# Altium schematic sheet display-header.SchDoc
size A
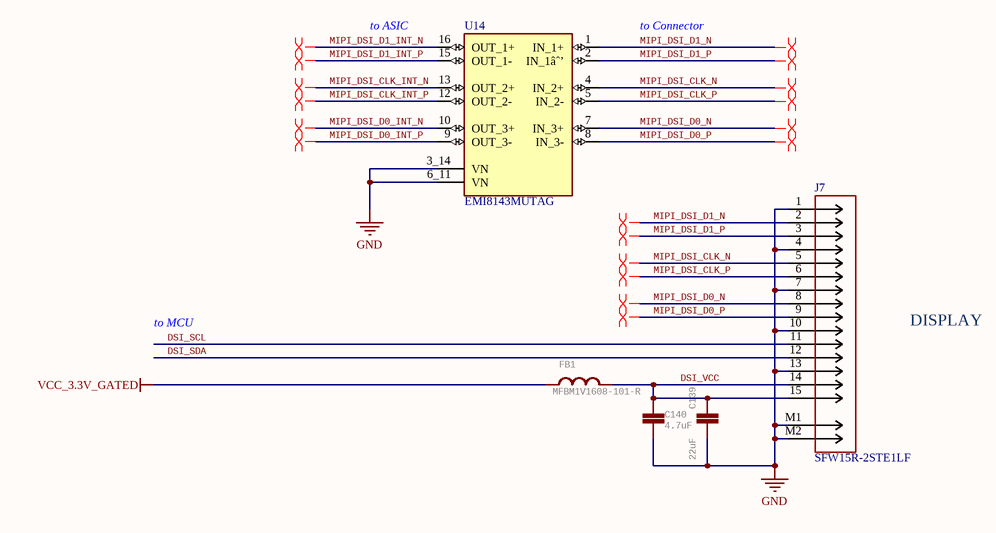
[diagram p0: display-header.SchDoc]

## Parts
C139  22uF  [0805]
C140  4.7uF  [0402-CAP]
FB1  MFBM1V1608-101-R  [0603-RES]
J7  SFW15R-2STE1LF  [CON15_1X15_DRB_SFW_JAE]
U14  EMI8143MUTAG  [IC_EMI8143MUTAG]

## Nets
GND: C139.2 C140.1 J7.1 J7.4 J7.7 J7.10 J7.13 J7.M1 J7.M2 U14.3_14(VN) U14.6_11(VN)
VCC_3.3V_GATED: FB1.1
DSI_SCL: J7.11
DSI_SDA: J7.12
DSI_VCC: C139.1 C140.2 FB1.2 J7.14 J7.15
MIPI_DSI_CLK_INT_N: U14.13(OUT_2+)
MIPI_DSI_CLK_INT_P: U14.12(OUT_2-)
MIPI_DSI_CLK_N: J7.5 U14.4(IN_2+)
MIPI_DSI_CLK_P: J7.6 U14.5(IN_2-)
MIPI_DSI_D0_INT_N: U14.10(OUT_3+)
MIPI_DSI_D0_INT_P: U14.9(OUT_3-)
MIPI_DSI_D0_N: J7.8 U14.7(IN_3+)
MIPI_DSI_D0_P: J7.9 U14.8(IN_3-)
MIPI_DSI_D1_INT_N: U14.16(OUT_1+)
MIPI_DSI_D1_INT_P: U14.15(OUT_1-)
MIPI_DSI_D1_N: J7.2 U14.1(IN_1+)
MIPI_DSI_D1_P: J7.3 U14.2(IN_1âˆ’)

## Layout directives
differential pair; differential pair class MIPI: MIPI_DSI_CLK_INT_N, MIPI_DSI_CLK_INT_P, MIPI_DSI_CLK_N, MIPI_DSI_CLK_P, MIPI_DSI_D0_INT_N, MIPI_DSI_D0_INT_P, MIPI_DSI_D0_N, MIPI_DSI_D0_P, MIPI_DSI_D1_INT_N, MIPI_DSI_D1_INT_P, MIPI_DSI_D1_N, MIPI_DSI_D1_P

## Notes on the sheet
- (near U14) to ASIC
- to Connector
- to MCU
- DISPLAY

## Library data of the parts
C139 = 22UF-0805-6.3V-20%: 22ÂµF ceramic capacitors    A capacitor is a passive two-terminal electrical component used to store electrical energy temporarily in an electric field.; MPN: CL21A226MQQNNNE; GateName_1: G$1; SymbolName_1: CAP; PROD_ID: CAP-08402; DeviceName: -0805-6.3V-20%; LibraryName: SparkFun-Capacitors; DeviceSetName: 22UF; Part Number: CL21A226MQQNNNE
C140 = CAP0402-CAP: CapacitorStandard 0603 ceramic capacitor, and 0.1" leaded capacitor.; MPN: JMK105BBJ475MV-F; GateName_1: G$1; SymbolName_1: CAP; DeviceName: 0402-CAP; LibraryName: sfe; DeviceSetName: CAP; Part Number: JMK105BBJ475MV-F
FB1 = INDUCTOR: InductorsBasic Inductor/Choke - 0603 and 1206. Footprints are not proven and vary greatly between part numbers.; GateName_1: G$1; MPN: MFBM1V1608-101-R; Part Number: MFBM1V1608-101-R
J7 = SFW15R-2STE1LF: No Description Available; MF: JAE Electronics; Copyright: Copyright (C) 2023 Ultra Librarian. All rights reserved.; MPN: SFW15R-2STE1LF; Part Number: SFW15R-2STE1LF
U14 = CMP-008-000000-1: 6 Line Common Mode Choke Surface Mount 100mA DCR 6Ohm (Typ); MF: ON Semiconductor; Design Item ID: EMI8143MUTAG; Source: EMI8143MUTAG.SchLib; Package: XDFN-16 ON Semiconductor; Pin Count: 14; MP: EMI8143MUTAG; Component Type: Standard; Digi-Key_Part_Number: EMI8143MUTAGOSCT-ND; Value: *; SnapEDA_Link: https://www.snapeda.com/parts/EMI8143MUTAG/ON%20Semiconductor/view-part/182093/?ref=snap; Purchase-URL: https://pricing.snapeda.com/search/part/EMI8143MUTAG/?ref=eda; MPN: EMI8143MUTAG; Part Number: EMI8143MUTAG